# EAGLE design power_board_v2 (EAGLE 9.6.2)
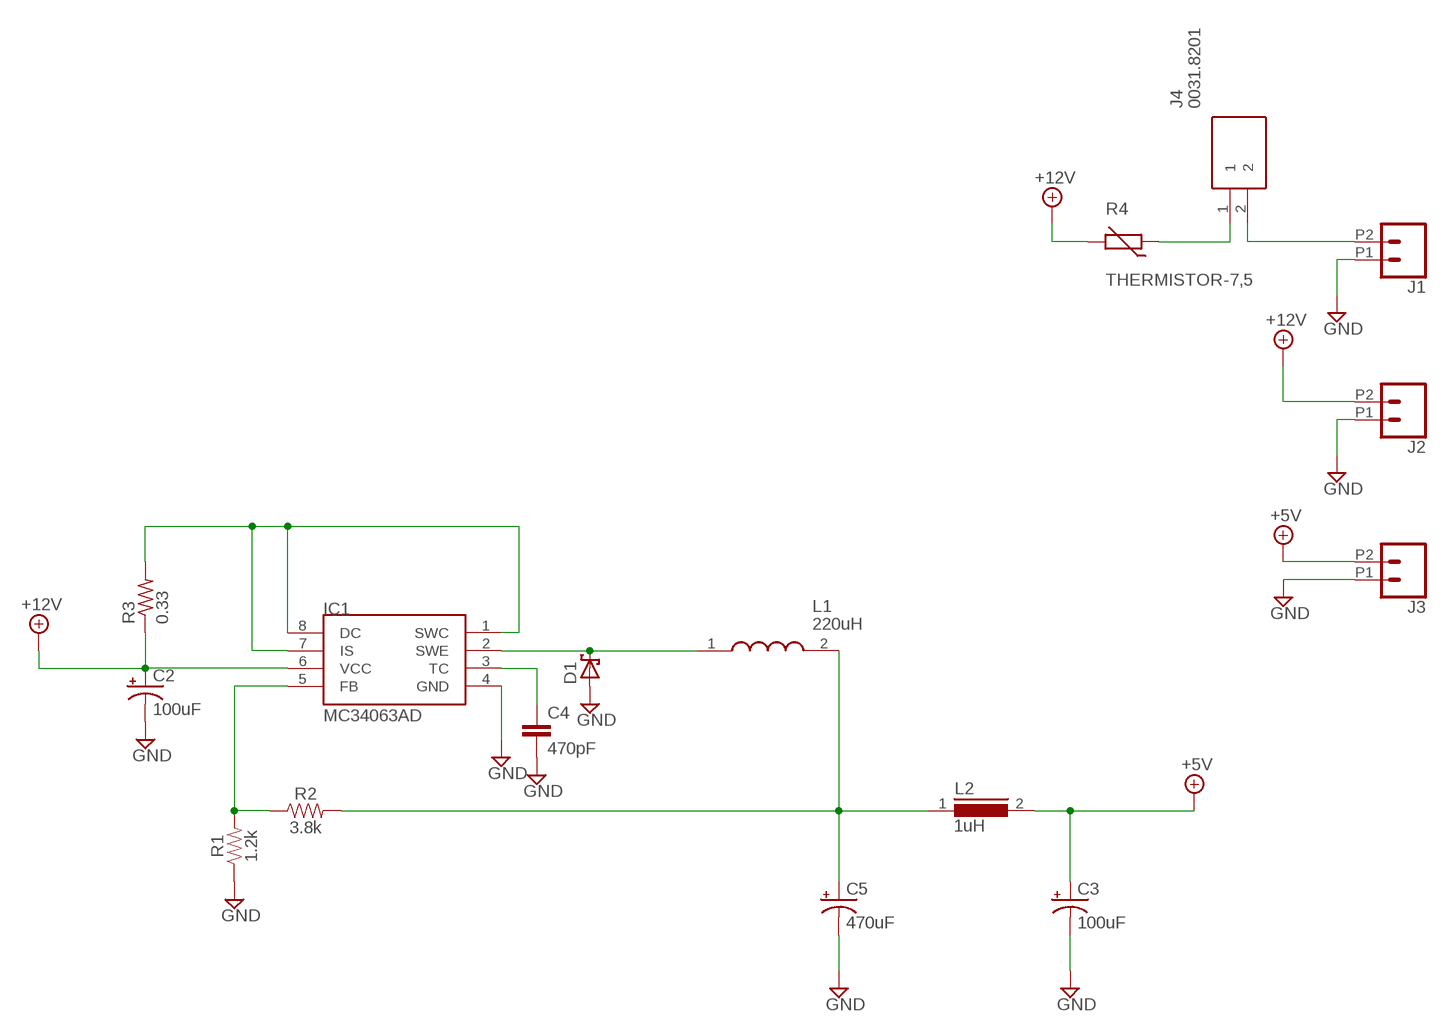
[diagram p0: schematic, sheet 1]

## Parts
C2  100uF  CPOL-USD  [PANASONIC_D]
C3  100uF  CPOL-USD  [PANASONIC_D]
C4  470pF  C-EUC0805  [C0805]
C5  470uF  CPOL-USF  [PANASONIC_F]
D1  SCHOTTKY-DIODEDO41  [DO41-10]
IC1  MC34063AD  [SOIC8]
J1  CONN_02SCREWTERMINAL-6.35MM-2  [1X02_6.35_SCREWTERM]
J2  CONN_02SCREWTERMINAL-6.35MM-2  [1X02_6.35_SCREWTERM]
J3  CONN_02SCREWTERMINAL-6.35MM-2  [1X02_6.35_SCREWTERM]
J4  0031.8201  [0031.8201]
L1  220uH  744772220  [WE-TI_809589]
L2  1uH  MICC12  [MICC12]
R1  1.2k  0.75OHM-0805-1/4W-1%  [0805]
R2  3.8k  0.75OHM-0805-1/4W-1%  [0805]
R3  0.33  R-US_R2512  [R2512]
R4  THERMISTOR-7,5  [R-7,5]

## Nets
+5V: C3.+ J3.P2 L2.2
+12V: C2.+ IC1.6(VCC) J2.P2 R3.1 R4.2
GND: C2.- C3.- C4.2 C5.- D1.A IC1.4(GND) J1.P1 J2.P1 J3.P1 R1.1
N$1: D1.C IC1.2(SWE) L1.1
N$2: C5.+ L1.2 L2.1 R2.2
N$3: IC1.1(SWC) IC1.7(IS) IC1.8(DC) R3.2
N$4: C4.1 IC1.3(TC)
N$5: IC1.5(FB) R1.2 R2.1
N$6: J1.P2 J4.2
N$7: J4.1 R4.1

## Library data of the parts
C2 C3 C5 = adafruit:CPOL-US: POLARIZED CAPACITOR, American symbol
C4 = rcl:C-EU: CAPACITOR, European symbol; SPICEPREFIX: C
D1 = adafruit:SCHOTTKY-DIODE: Schottky Diode
IC1 = mc34063:MC34063
J1-J3 = SparkFun-Connectors:CONN_02: Multi connection point. Often used as Generic Header-pin footprint for 0.1 inch spaced/style header connections On any of the 0.1 inch spaced packages, you can populate with these: Break Away Headers - Straight <https://www.sparkfun.com/products/116> (PRT-00116) Break Away Male Headers - Right Angle <https://www.sparkfun.com/products/553> (PRT-00553) Female Headers <https://www.sparkfun.com/products/115> (PRT-00115) Break Away Headers - Machine Pin <https://www.sparkfun.com/products/117> (PRT-00117) Break Away Female Headers - Swiss Machine Pin <https://www.sparkfun.com/products/743> (PRT-00743) For SCREWTERMINALS and SPRING TERMINALS visit here: Screw Terimnals on SparkFun.com <https://www.sparkfun.com/search/results?term=Screw+Terminals> (5mm/3.5mm/2.54mm spacing) This device is also useful as a general connection point to wire up your design to another part of your project. Our various solder wires solder well into these plated through hole pads. Hook-Up Wire - Assortment (Stranded, 22 AWG) <https://www.sparkfun.com/products/11375> (PRT-11375) Hook-Up Wire - Assortment (Solid Core, 22 AWG) <https://www.sparkfun.com/products/11367> (PRT-11367) View the entire wire category on our website here <https://www.sparkfun.com/categories/141> Special notes: Molex polarized connector foot print use with: PRT-08233 with associated crimp pins and housings. 2.54_SCREWTERM for use with PRT-10571. 3.5mm Screw Terminal footprints for PRT-08084 5mm Screw Terminal footprints for use with PRT-08432; PROD_ID: CONN-15154
J4 = SamacSys_Parts:0031.8201: Fuse Holder FUSE-HOLDER OGN Source: Datasheet <http://uk.rs-online.com/web/p/products/2508764386>; DESCRIPTION: Fuse Holder FUSE-HOLDER OGN; HEIGHT: mm; MANUFACTURER_NAME: SCHURTER; MANUFACTURER_PART_NUMBER: 0031.8201; RS_PART_NUMBER: 2508764386; RS_PRICE-STOCK: http://uk.rs-online.com/web/p/products/2508764386
L1 = SamacSys_Parts:744772220: Wurth 22 uH +/-10% Ferrite Radial Inductor, 2.3A Idc, 0.055 Rdc WE-TI Source: Datasheet <http://uk.rs-online.com/web/p/products/4890043P>; DESCRIPTION: Wurth 22 uH +/-10% Ferrite Radial Inductor, 2.3A Idc, 0.055 Rdc WE-TI; HEIGHT: mm; MANUFACTURER_NAME: Wurth Elektronik; MANUFACTURER_PART_NUMBER: 744772220; RS_PART_NUMBER: 4890043P; RS_PRICE-STOCK: http://uk.rs-online.com/web/p/products/4890043P
L2 = inductors:MICC12: INDUCTOR
R1 R2 = SparkFun-Resistors:0.75OHM: 0.75Ω resistor A resistor is a passive two-terminal electrical component that implements electrical resistance as a circuit element. Resistors act to reduce current flow, and, at the same time, act to lower voltage levels within circuits. - Wikipedia; PROD_ID: RES-08474; VALUE: 0.75
R3 = adafruit:R-US_: RESISTOR, American symbol
R4 = varistor:THERMISTOR: THERMISTOR

## Board
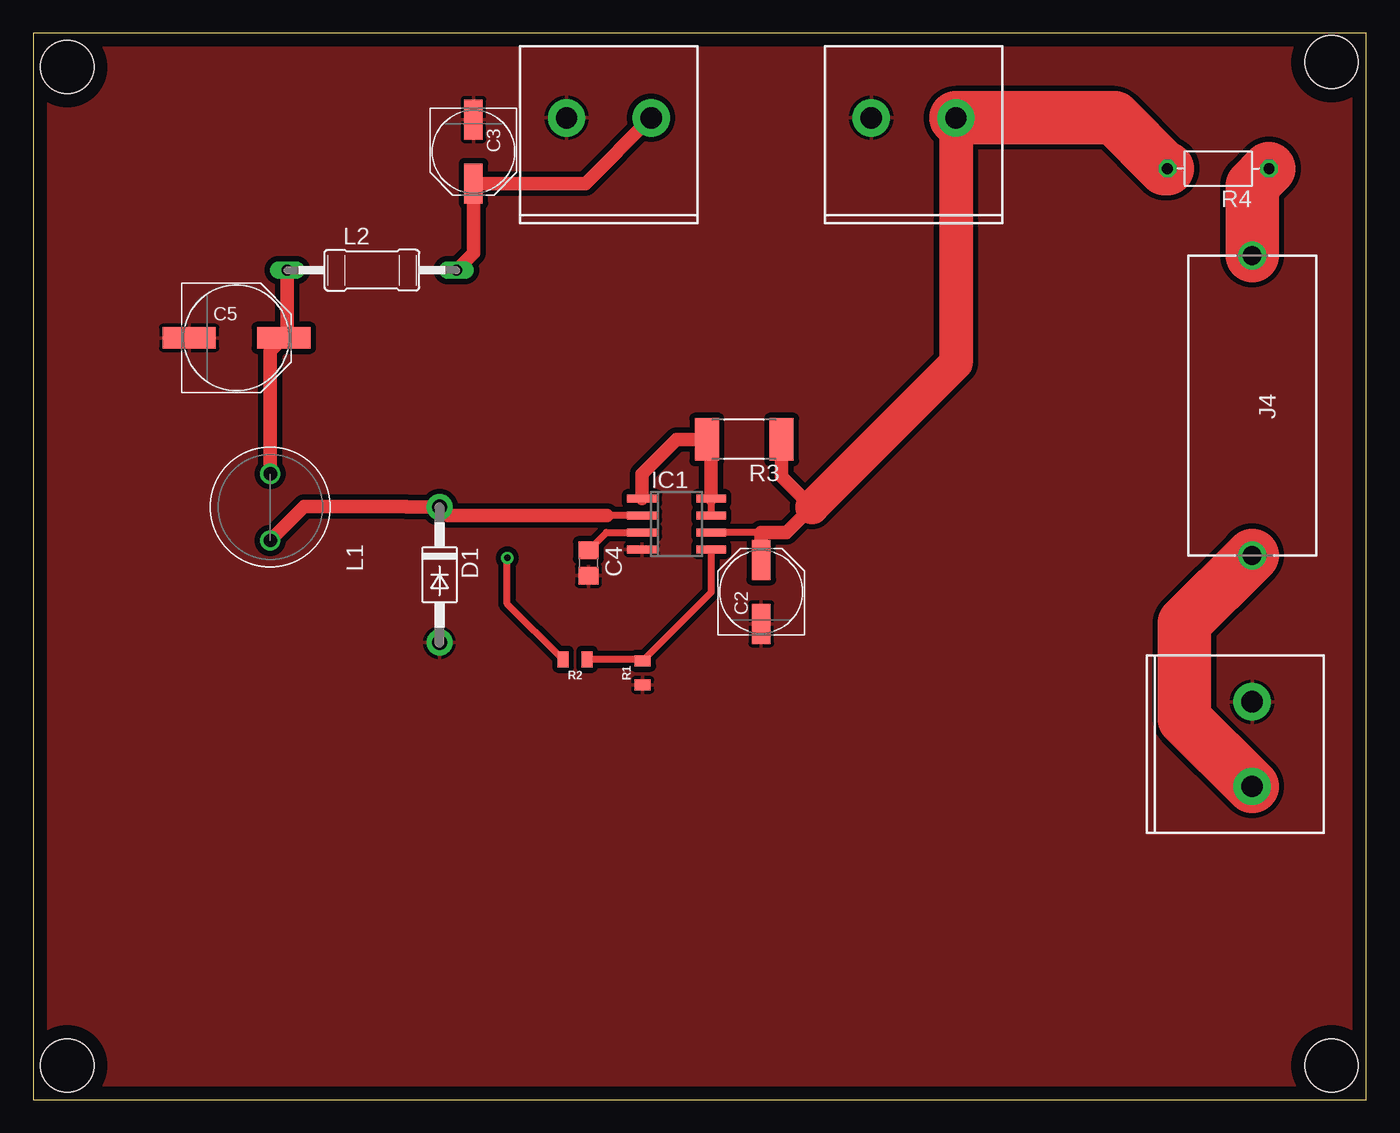
[diagram p1: board, top side]
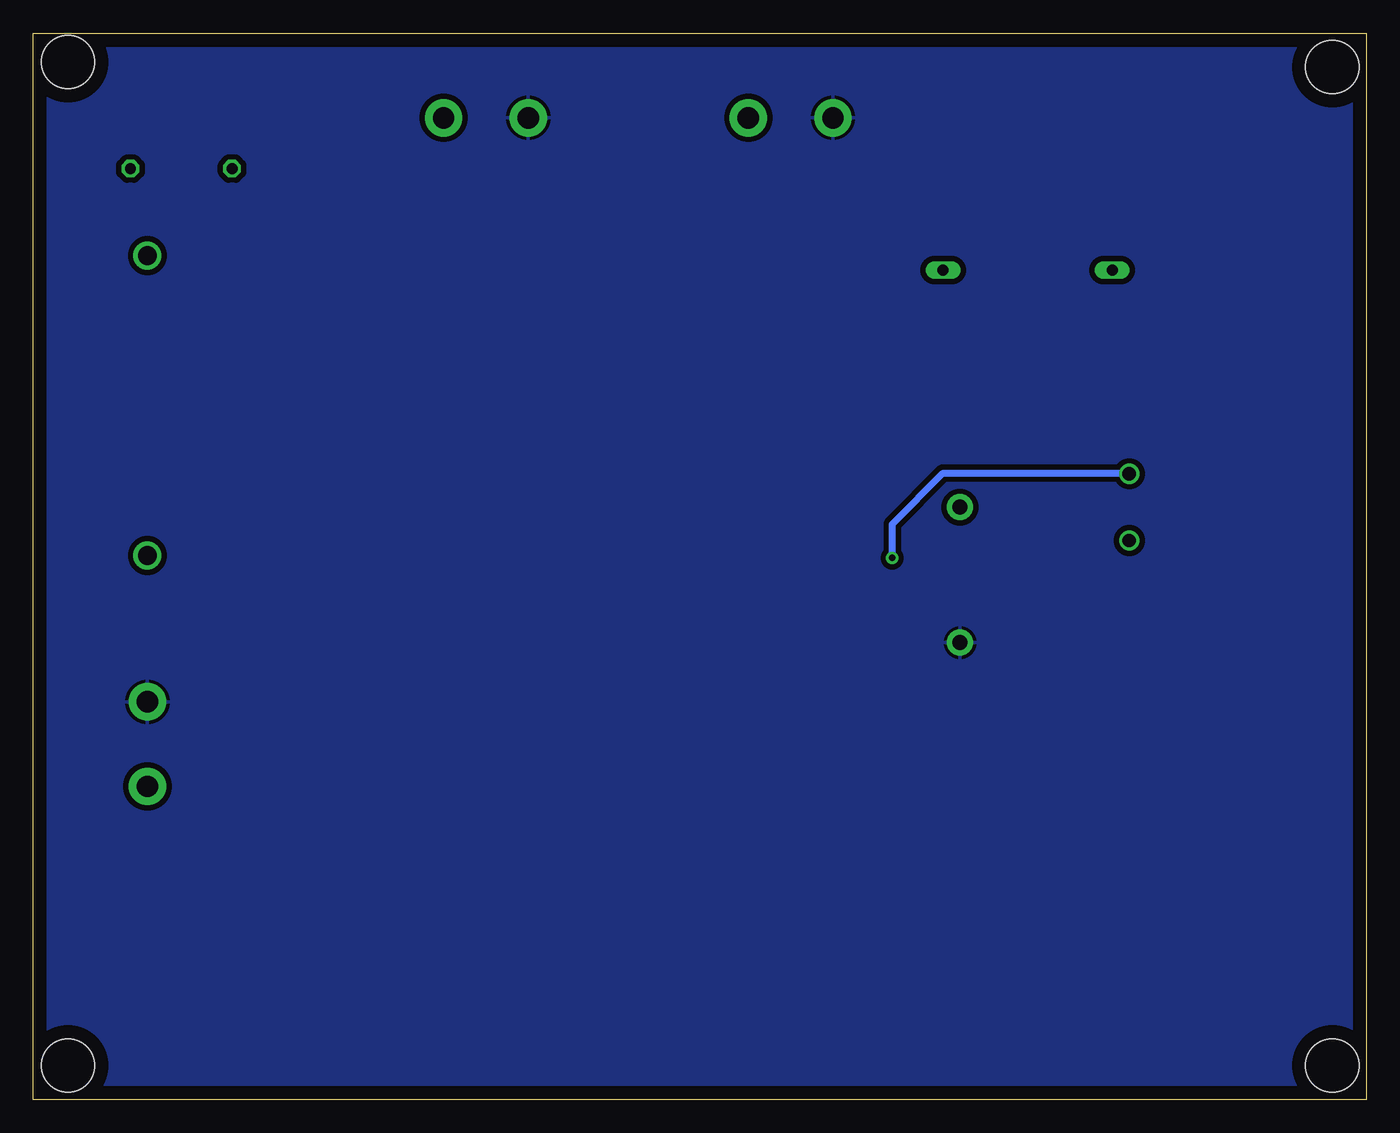
[diagram p2: board, bottom side, seen from below]

Size 100 x 80 mm. Coordinates in mm from the lower left corner, seen from the top.
Outline: 0,0 100,0 100,80 0,80 0,0
Copper layers (1*16): Top 0.035mm / dielectric 1.5mm / Bottom 0.035mm
Design rules "default": minimum track width 6mil, minimum drill 0.35mm, track to track 6mil, track to pad 6mil, pad to pad 6mil, via to via 6mil, smd to smd 6mil, copper to edge 40mil, drill to drill 6mil, minimum pad ring 10mil, minimum via ring 8mil, stop-mask expansion 4mil, vias tented up to drill 0mil, thermal gap 10mil
Holes 4 mm at 2.54,77.47 2.54,2.54 97.41,2.54 97.41,77.85

### Footprints (pad centres in the part's own frame; a part is rotated, then mirrored left to right if it is on the bottom)
PANASONIC_D = smd 3 x 1.4: + 2.4,0; - -2.4,0
C0805 = smd 1.3 x 1.5: 1 -0.95,0; 2 0.95,0
PANASONIC_F = smd 4 x 1.6: + 3.55,0; - -3.55,0
DO41-10 = drill 1.118 pad 1.93: A 5.08,0; C -5.08,0
SOIC8 = smd 0.6 x 2.2: 1 -1.905,-2.6; 2 -0.635,-2.6; 3 0.635,-2.6; 4 1.905,-2.6; 5 1.905,2.6; 6 0.635,2.6; 7 -0.635,2.6; 8 -1.905,2.6
1X02_6.35_SCREWTERM = drill 1.6 pad 2.8: P1 -3.175,0; P2 3.175,0
0031.8201 = drill 1.4 pad 2.1: 1 -11.25,0; 2 11.25,0
WE-TI_809589 = drill 1 pad 1.5: 1 -2.5,0; 2 2.5,0
MICC12 = drill 0.813 long: 1 -6.35,0; 2 6.35,0
0805 = smd 0.8 x 1.2: 1 -0.9,0; 2 0.9,0
R2512 = smd 1.8 x 3.2: 1 -2.8,0; 2 2.8,0
R-7,5 = drill 0.813 octagon: 1 -3.81,0; 2 3.81,0

### Placement (x,y rotation side)
C2  54.61,38.1 90 top
C3  33.02,71.12 270 top
C4  41.66,40.26 270 top
C5  15.24,57.15 0 top
D1  30.48,39.37 270 top
IC1  48.26,43.18 270 top
J1  91.44,26.67 270 top
J2  66.04,73.66 0 top
J3  43.18,73.66 0 top
J4  91.44,52.07 270 top
L1  17.78,44.45 90 top
L2  25.4,62.23 0 top
R1  45.72,32 90 top
R2  40.64,33.02 180 top
R3  53.34,49.53 180 top
R4  88.9,69.85 180 top

### Tracks (layer width: path | path; a pad name or v marks a point on that pad's centre or on a via)
+5V
  Top 1.016: J3.P2 41.41,68.72 C3.+ 33.02,63.5 L2.2
+12V
  Top 0.508: 54.61,42.55 IC1.6
  Top 1.016: R3.1 56.14,46.73 58.42,44.45 56.52,42.55 54.61,42.55 C2.+
  Top 2.54: J2.P2 69.22,55.24 58.42,44.45
  Top 4: J2.P2 81.1,73.66 84.91,69.85 R4.2
GND
  pour Top (isolate 0.406): 0,0 100.33,0 100.33,80.01 0,80.01
  pour Bottom (isolate 0.406): 0,0 100.33,0 100.33,80.01 0,80.01
N$1
  Top 0.508: IC1.2 43.05,43.81
  Top 1.016: L1.1 20.32,44.49 27.98,44.49 28.02,44.45 D1.C 31.11,43.81 43.05,43.81
N$2  (via drill 0.5)
  Top 0.508: R2.2 35.56,37.2 v35.56,40.64
  Top 1.016: L1.2 17.78,56.14 C5.+ 19.05,57.41 L2.1
  Bottom 0.508: v35.56,40.64 35.56,43.18 31.75,46.99 17.82,46.99 L1.2
N$3
  Top 0.508: IC1.8 IC1.7
  Top 1.016: IC1.8 50.86,49.21 R3.2 48.26,49.53 45.66,46.93 IC1.1
N$4
  Top 0.508: C4.1 42.99,42.55 IC1.3
N$5
  Top 0.508: IC1.5 50.86,38.04 R1.2 45.6,33.02 R2.1
N$6
  Top 4: J1.P2 86.36,28.57 86.36,35.74 J4.2
N$7
  Top 4: J4.1 91.44,68.58 R4.1